# Altium schematic sheet toplevel.SchDoc
size A4
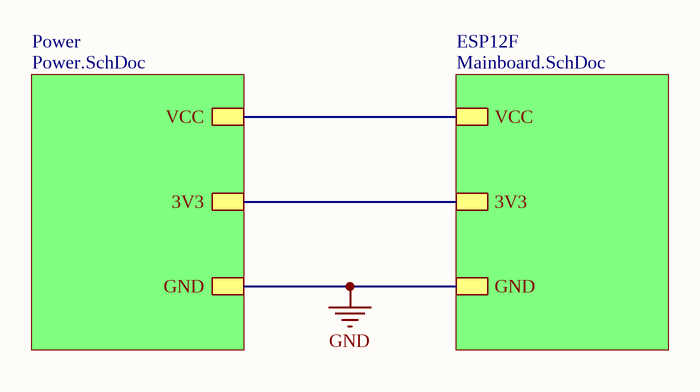
[diagram p0: toplevel.SchDoc]

## Sub-sheets
ESP12F = Mainboard.SchDoc: GND, 3V3, VCC
Power = Power.SchDoc: GND, 3V3, VCC

## Nets
GND: sheet ESP12F/GND, sheet Power/GND
(unnamed): sheet ESP12F/3V3, sheet Power/3V3
(unnamed): sheet ESP12F/VCC, sheet Power/VCC